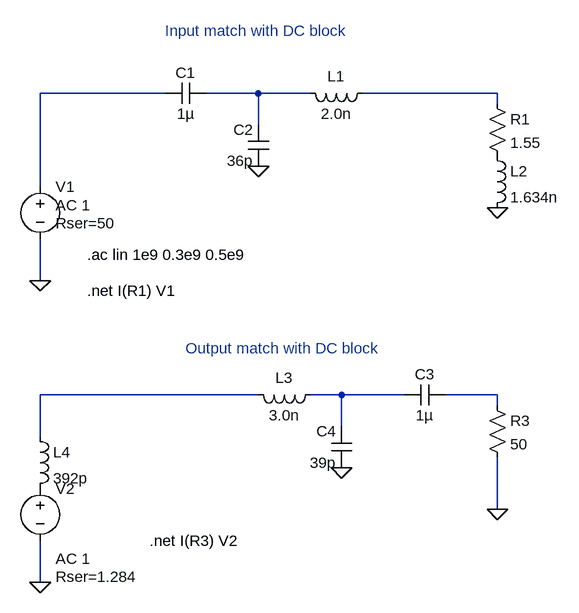
[diagram p0: schematic PA_board.asc]
PA_board.asc, the LTspice schematic file:
Version 4
SHEET 1 1864 680
WIRE 224 -576 32 -576
WIRE 368 -576 288 -576
WIRE 448 -576 368 -576
WIRE 736 -576 528 -576
WIRE 736 -560 736 -576
WIRE 368 -528 368 -576
WIRE 32 -432 32 -576
WIRE 32 -288 32 -352
WIRE 368 -112 32 -112
WIRE 496 -112 448 -112
WIRE 592 -112 496 -112
WIRE 736 -112 656 -112
WIRE 736 -96 736 -112
WIRE 496 -64 496 -112
WIRE 32 -48 32 -112
WIRE 736 64 736 -16
WIRE 32 176 32 112
FLAG 32 -288 0
FLAG 368 -464 0
FLAG 736 -400 0
FLAG 32 176 0
FLAG 496 0 0
FLAG 736 64 0
SYMBOL cap 288 -592 R90
WINDOW 0 0 32 VBottom 2
WINDOW 3 32 32 VTop 2
SYMATTR InstName C1
SYMATTR Value 1µ
SYMBOL cap 384 -464 R180
WINDOW 0 24 56 Left 2
WINDOW 3 24 8 Left 2
SYMATTR InstName C2
SYMATTR Value 36p
SYMBOL ind 544 -592 R90
WINDOW 0 5 56 VBottom 2
WINDOW 3 32 56 VTop 2
SYMATTR InstName L1
SYMATTR Value 2.0n
SYMBOL voltage 32 -448 R0
WINDOW 123 24 44 Left 2
WINDOW 39 24 72 Left 2
SYMATTR InstName V1
SYMATTR Value ""
SYMATTR Value2 AC 1
SYMATTR SpiceLine Rser=50
SYMBOL res 720 -576 R0
SYMATTR InstName R1
SYMATTR Value 1.55
SYMBOL ind 720 -496 R0
SYMATTR InstName L2
SYMATTR Value 1.634n
SYMBOL cap 512 0 R180
WINDOW 0 24 56 Left 2
WINDOW 3 24 8 Left 2
SYMATTR InstName C4
SYMATTR Value 39p
SYMBOL ind 464 -128 R90
WINDOW 0 5 56 VBottom 2
WINDOW 3 32 56 VTop 2
SYMATTR InstName L3
SYMATTR Value 3.0n
SYMBOL voltage 32 16 R0
WINDOW 123 24 124 Left 2
WINDOW 39 24 152 Left 2
SYMATTR InstName V2
SYMATTR Value ""
SYMATTR Value2 AC 1
SYMATTR SpiceLine Rser=1.284
SYMBOL res 720 -112 R0
SYMATTR InstName R3
SYMATTR Value 50
SYMBOL cap 656 -128 R90
WINDOW 0 0 32 VBottom 2
WINDOW 3 32 32 VTop 2
SYMATTR InstName C3
SYMATTR Value 1µ
SYMBOL ind 16 -64 R0
SYMATTR InstName L4
SYMATTR Value 392p
TEXT 104 -328 Left 2 !.ac lin 1e9 0.3e9 0.5e9
TEXT 200 112 Left 2 !.net I(R3) V2
TEXT 104 -272 Left 2 !.net I(R1) V1
TEXT 224 -672 Left 2 ;Input match with DC block
TEXT 256 -184 Left 2 ;Output match with DC block

The netlist it stands for:
* PA_board.asc
C1 N002 N001 1µ
C2 0 N002 36p
L1 N003 N002 2.0n
V1 N001 0 AC 1 Rser=50
R1 N003 P001 1.55
L2 P001 0 1.634n
C4 0 N005 39p
L3 N005 N004 3.0n
V2 P002 0 AC 1 Rser=1.284
R3 N006 0 50
C3 N006 N005 1µ
L4 N004 P002 392p
.ac lin 1e9 0.3e9 0.5e9
.net I(R3) V2
.net I(R1) V1
* Input match with DC block
* Output match with DC block
.backanno
.end